# EAGLE design breakout (EAGLE 6.6.0)
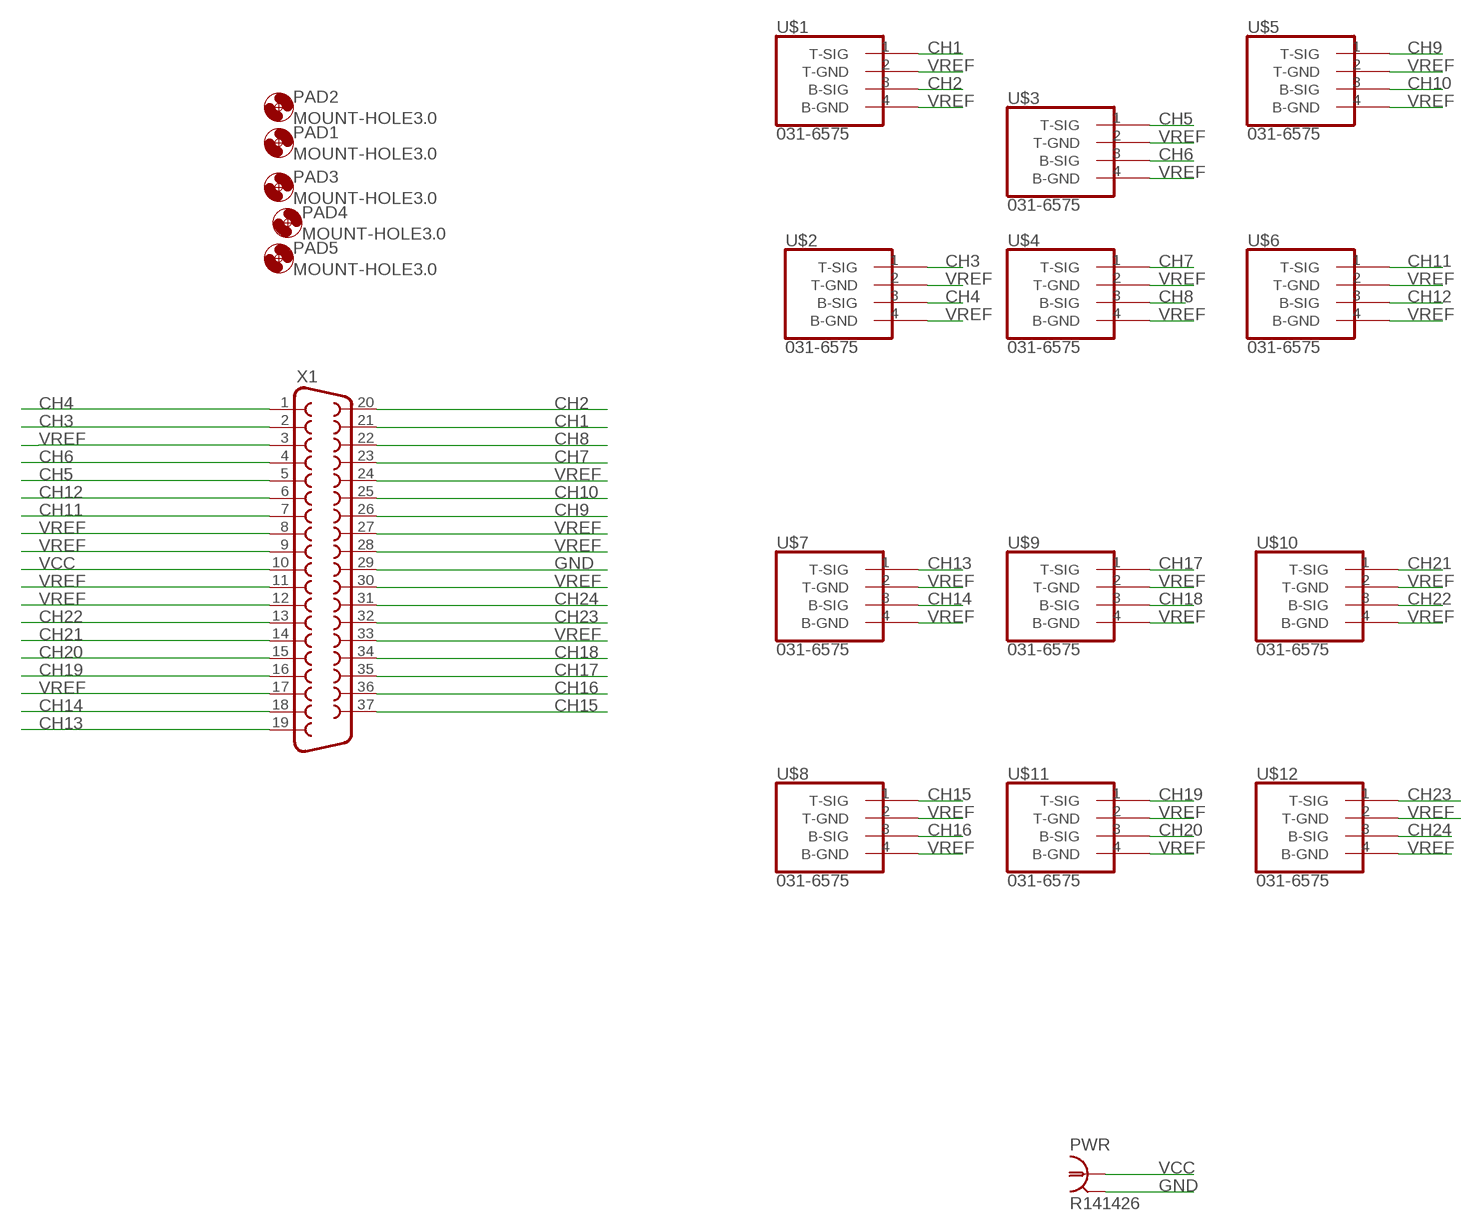
[diagram p0: schematic, sheet 1]

## Parts
PAD1  MOUNT-HOLE3.0  [3,0]
PAD2  MOUNT-HOLE3.0  [3,0]
PAD3  MOUNT-HOLE3.0  [3,0]
PAD4  MOUNT-HOLE3.0  [3,0]
PAD5  MOUNT-HOLE3.0  [3,0]
PWR  R141426  [R141426]
U$1  031-6575  [031-6575]
U$2  031-6575  [031-6575]
U$3  031-6575  [031-6575]
U$4  031-6575  [031-6575]
U$5  031-6575  [031-6575]
U$6  031-6575  [031-6575]
U$7  031-6575  [031-6575]
U$8  031-6575  [031-6575]
U$9  031-6575  [031-6575]
U$10  031-6575  [031-6575]
U$11  031-6575  [031-6575]
U$12  031-6575  [031-6575]
X1  F37HP  [F37HP]

## Nets
CH1: U$1.1(T-SIG) X1.21
CH2: U$1.3(B-SIG) X1.20
CH3: U$2.1(T-SIG) X1.2
CH4: U$2.3(B-SIG) X1.1
CH5: U$3.1(T-SIG) X1.5
CH6: U$3.3(B-SIG) X1.4
CH7: U$4.1(T-SIG) X1.23
CH8: U$4.3(B-SIG) X1.22
CH9: U$5.1(T-SIG) X1.26
CH10: U$5.3(B-SIG) X1.25
CH11: U$6.1(T-SIG) X1.7
CH12: U$6.3(B-SIG) X1.6
CH13: U$7.1(T-SIG) X1.19
CH14: U$7.3(B-SIG) X1.18
CH15: U$8.1(T-SIG) X1.37
CH16: U$8.3(B-SIG) X1.36
CH17: U$9.1(T-SIG) X1.35
CH18: U$9.3(B-SIG) X1.34
CH19: U$11.1(T-SIG) X1.16
CH20: U$11.3(B-SIG) X1.15
CH21: U$10.1(T-SIG) X1.14
CH22: U$10.3(B-SIG) X1.13
CH23: U$12.1(T-SIG) X1.32
CH24: U$12.3(B-SIG) X1.31
GND: PWR.2 PWR.3 PWR.4 PWR.5 X1.29
VCC: PWR.1 X1.10
VREF: U$1.2(T-GND) U$1.4(B-GND) U$2.2(T-GND) U$2.4(B-GND) U$3.2(T-GND) U$3.4(B-GND) U$4.2(T-GND) U$4.4(B-GND) U$5.2(T-GND) U$5.4(B-GND) U$6.2(T-GND) U$6.4(B-GND) U$7.2(T-GND) U$7.4(B-GND) U$8.2(T-GND) U$8.4(B-GND) U$9.2(T-GND) U$9.4(B-GND) U$10.2(T-GND) U$10.4(B-GND) U$11.2(T-GND) U$11.4(B-GND) U$12.2(T-GND) U$12.4(B-GND) X1.3 X1.8 X1.9 X1.11 X1.12 X1.17 X1.24 X1.27 X1.28 X1.30 X1.33

## Library data of the parts
PAD1-PAD5 = holes:MOUNT-HOLE: MOUNTING HOLE with drill center marker
PWR = con-coax:R141426: BNC COAX CONNECTOR Radiall 50/75 Ohm Spoerle; MF: FARNELL; MPN: R141426161; OC_FARNELL: 4195115; OC_NEWARK: 14J7919
U$1-U$12 = 031-6575:031-6575: Dual Row BNC Socket Description: BNC Connector Jack, Female Sockets - Dual 50 Ohm Panel Mount, Bulkhead; Through Hole, Right Angle Solder Manufacturer: Amphenol-RF Division Digi-Key Part Number: ARF2111-ND Manufacturer Part Number: 031-6575
X1 = con-subd:F37: SUB-D; OC_FARNELL: unknown; OC_NEWARK: unknown

## Board
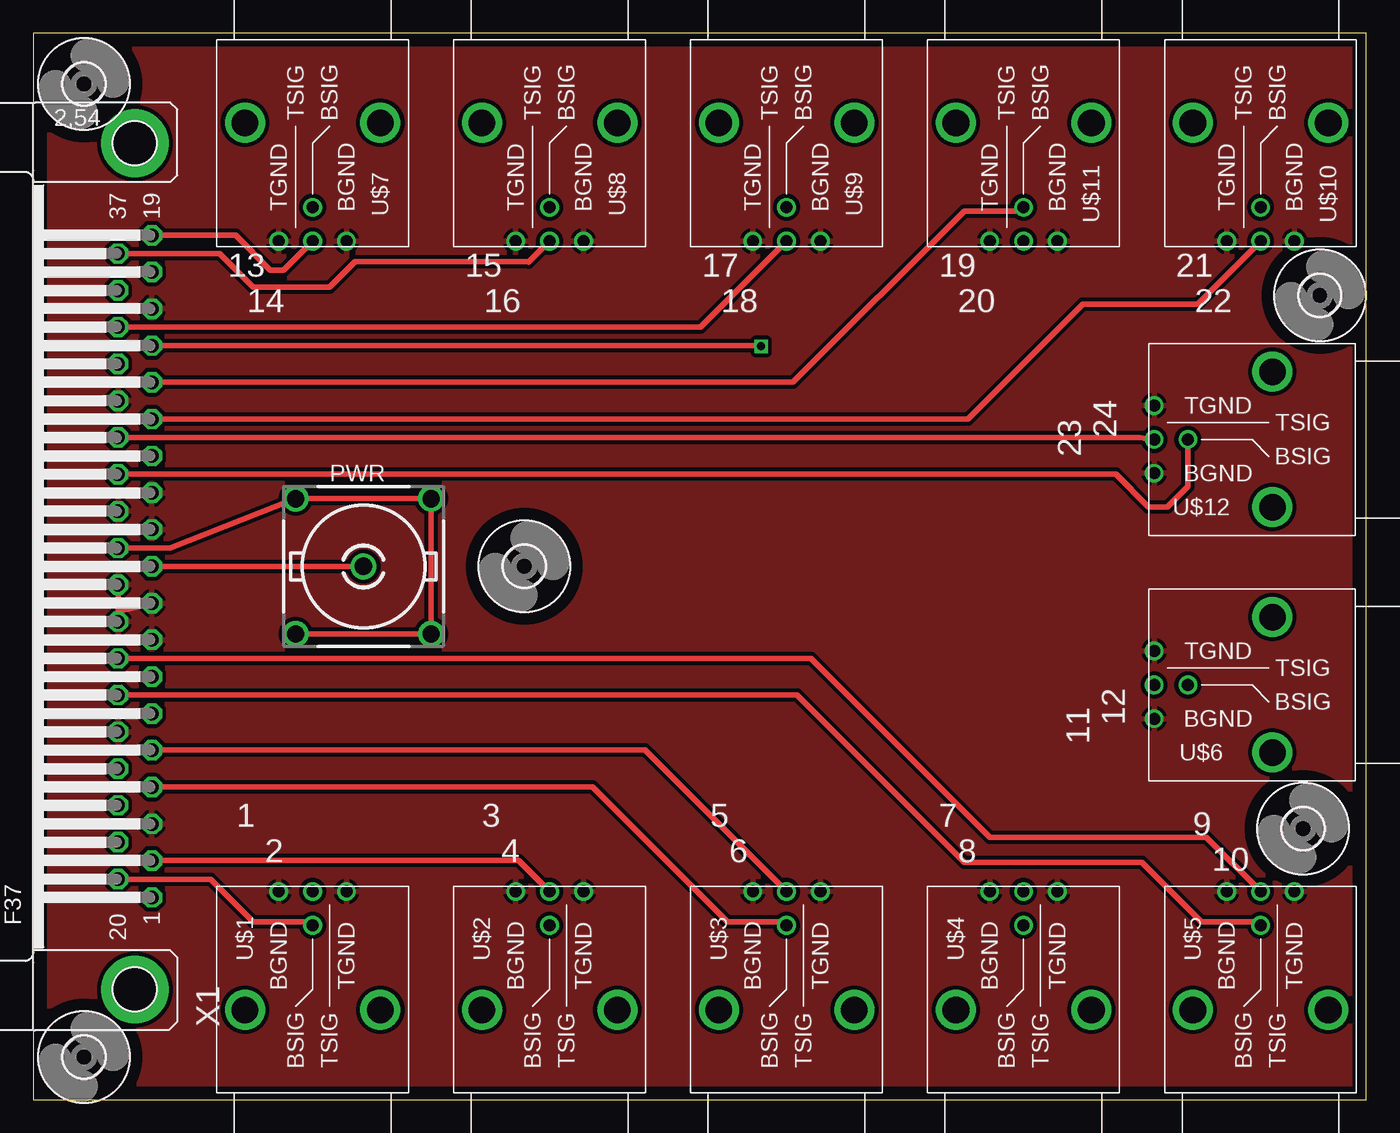
[diagram p1: board, top side]
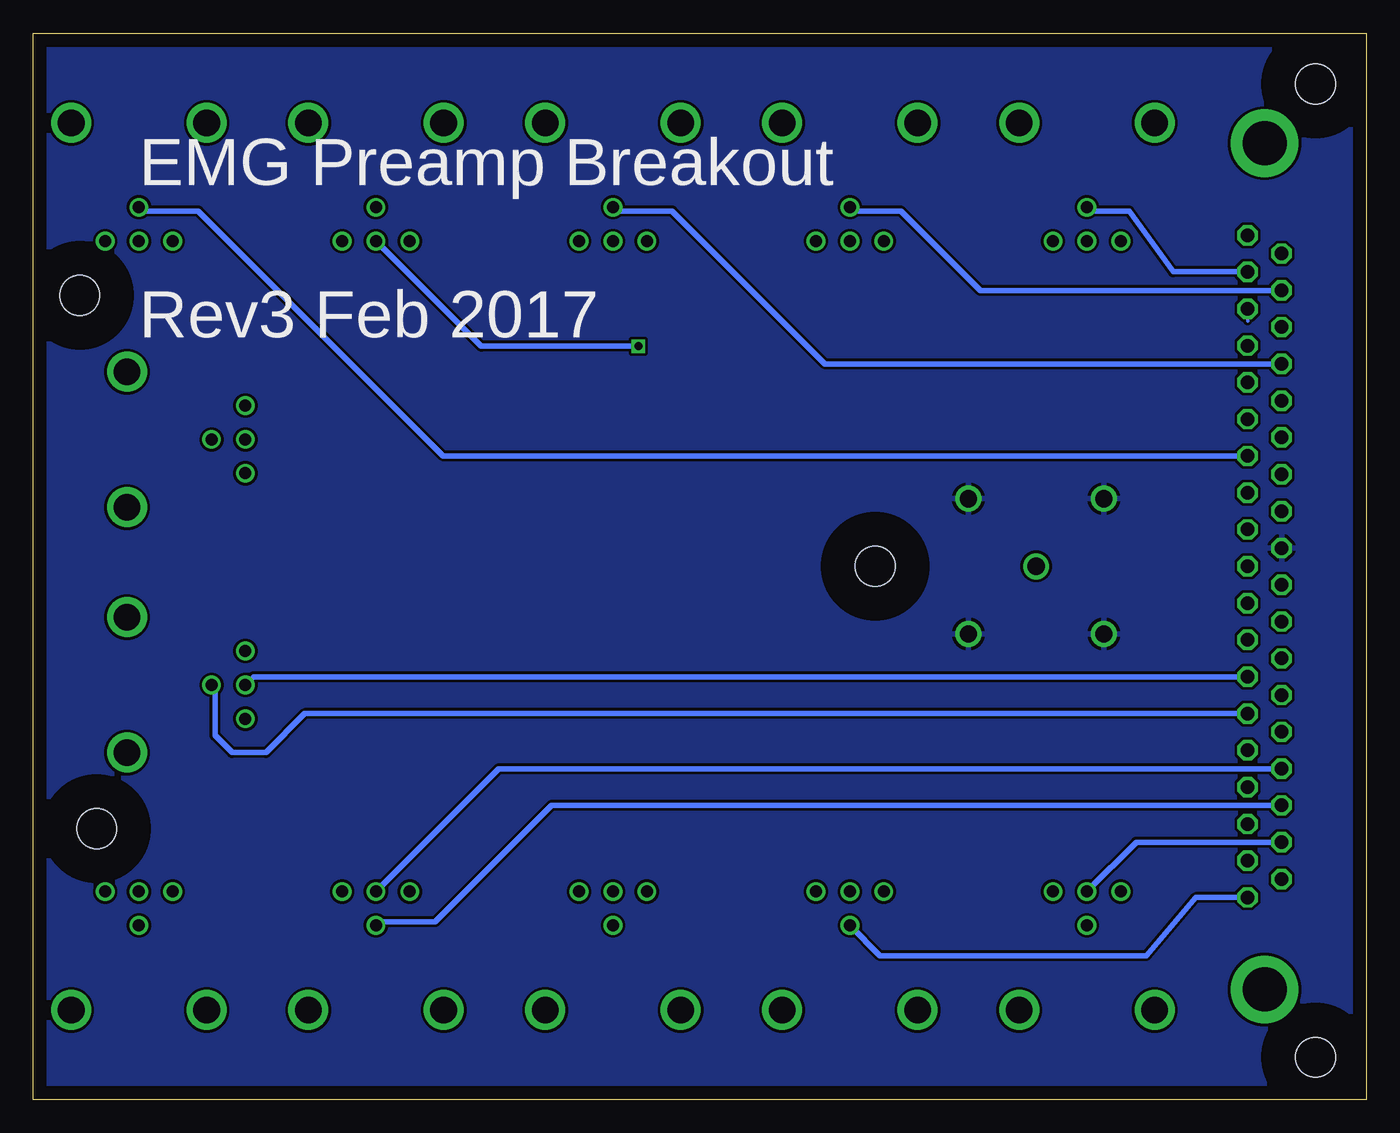
[diagram p2: board, bottom side, seen from below]

Size 100 x 80 mm. Coordinates in mm from the lower left corner, seen from the top.
Outline: 0,0 100,0 100,80 0,80 0,0
Copper layers (1*16): Top 0.035mm / dielectric 1.5mm / Bottom 0.035mm
Design rules "default *": minimum track width 10mil, minimum drill 10mil, track to track 8mil, track to pad 8mil, pad to pad 8mil, via to via 8mil, smd to smd 8mil, copper to edge 40mil, drill to drill 8mil, minimum pad ring 10mil, minimum via ring 8mil, stop-mask expansion 4mil, vias tented up to drill 0mil, thermal gap 10mil

### Footprints (pad centres in the part's own frame; a part is rotated, then mirrored left to right if it is on the bottom)
3,0 = hole 3: 0,0
R141426 = drill 1.295: 1 0,0; 2 5.08,5.08; 3 -5.08,5.08; 4 -5.08,-5.08; 5 5.08,-5.08
031-6575 = drill 0.9: 1 7.35,0; 2 7.35,-2.54; 3 4.81,0; 4 7.35,2.54 | drill 2: P$6 -1.53,5.08; P$7 -1.53,-5.08
F37HP = drill 1.016 octagon: 1 -24.841,-1.27; 2 -22.073,-1.27; 3 -19.329,-1.27; 4 -16.561,-1.27; 5 -13.792,-1.27; 6 -11.049,-1.27; 7 -8.28,-1.27; 8 -5.512,-1.27; 9 -2.769,-1.27; 10 0,-1.27; 11 2.769,-1.27; 12 5.512,-1.27; 13 8.28,-1.27; 14 11.049,-1.27; 15 13.818,-1.27; 16 16.561,-1.27; 17 19.329,-1.27; 18 22.098,-1.27; 19 24.841,-1.27; 20 -23.47,1.27; 21 -20.701,1.27; 22 -17.932,1.27; 23 -15.189,1.27; 24 -12.421,1.27; 25 -9.652,1.27; 26 -6.909,1.27; 27 -4.14,1.27; 28 -1.372,1.27; 29 1.372,1.27; 30 4.14,1.27; 31 6.909,1.27; 32 9.677,1.27; 33 12.421,1.27; 34 15.189,1.27; 35 17.958,1.27; 36 20.701,1.27; 37 23.47,1.27 | drill 3.302 pad 5.08: G1 -31.75,0; G2 31.75,0

### Placement (x,y rotation side)
PAD1  3.81,3.17 0 top
PAD2  3.81,76.2 0 top
PAD3  95.25,20.32 0 top
PAD4  96.52,60.33 0 top
PAD5  36.83,40.01 0 top
PWR  24.77,40.01 0 top
U$1  20.95,8.26 90 top
U$2  38.73,8.26 90 top
U$3  56.52,8.26 90 top
U$4  74.3,8.26 90 top
U$5  92.08,8.26 90 top
U$6  91.44,31.11 180 top
U$7  20.95,71.75 270 top
U$8  38.73,71.75 270 top
U$9  56.52,71.75 270 top
U$10  92.08,71.75 270 top
U$11  74.3,71.75 270 top
U$12  91.44,49.53 180 top
X1  7.62,40.01 90 top

### Tracks (layer width: path | path; a pad name or v marks a point on that pad's centre or on a via)
CH1
  Bottom 0.406: X1.21 17.26,19.3 U$1.1
CH2
  Top 0.406: X1.20 13.31,16.54 16.51,13.34 20.68,13.34 U$1.3
CH3
  Top 0.406: X1.2 36.41,17.93 U$2.1
CH4
  Bottom 0.406: X1.1 12.78,15.16 16.51,10.79 36.47,10.79 U$2.3
CH5
  Top 0.406: X1.5 45.91,26.21 U$3.1
CH6
  Top 0.406: X1.4 41.96,23.44 52.07,13.34 56.24,13.34 U$3.3
CH7
  Bottom 0.406: X1.23 65.08,24.82 U$4.1
CH8
  Bottom 0.406: X1.22 61.11,22.07 69.85,13.34 74.03,13.34 U$4.3
CH9
  Top 0.406: X1.26 58.34,33.1 71.75,19.68 88,19.68 U$5.1
CH10
  Top 0.406: X1.25 57.28,30.35 69.85,17.78 83.19,17.78 87.63,13.34 91.81,13.34 U$5.3
CH11
  Bottom 0.406: X1.7 83.48,31.73 U$6.1
CH12
  Bottom 0.406: X1.6 79.63,28.96 82.55,26.04 85.09,26.04 86.36,27.3 86.36,30.84 U$6.3
CH13
  Top 0.406: X1.19 15.16,64.85 17.78,62.23 18.78,62.23 U$7.1
CH14
  Bottom 0.406: X1.18 14.48,62.1 17.78,66.67 20.68,66.67 U$7.3
CH15
  Top 0.406: 37.17,62.84 37.2,62.87 | 37.2,62.87 U$8.1 | X1.37 13.99,63.48 16.51,60.96 22.23,60.96 24.13,62.87 37.2,62.87
CH16
  Bottom 0.406: X1.36 28.96,60.71 34.92,66.67 38.47,66.67 U$8.3
CH17
  Top 0.406: U$9.1 50.07,57.96 X1.35
CH18
  Bottom 0.406: X1.34 40.59,55.19 52.07,66.67 56.24,66.67 U$9.3
CH19  (via drill 0.6)
  Top 0.406: X1.16 54.56,56.57 v54.61,56.52
  Bottom 0.406: v54.61,56.52 66.41,56.52 U$11.1
CH20
  Top 0.406: X1.15 57,53.82 69.85,66.67 74.03,66.67 U$11.3
CH21
  Top 0.406: X1.14 70.1,51.05 78.74,59.69 87.36,59.69 U$10.1
CH22
  Bottom 0.406: X1.13 69.24,48.28 87.63,66.67 91.81,66.67 U$10.3
CH23
  Top 0.406: X1.32 82.97,49.68 U$12.1
CH24
  Top 0.406: X1.31 81.2,46.91 83.67,44.45 85.09,44.45 86.63,45.99 U$12.3
GND
  Top 0.406: PWR.4 PWR.5 PWR.2 PWR.3 10.26,41.38 X1.29
  pour Bottom: 0,80.01 0,0 99.69,0 99.69,80.01
VCC
  Top 0.406: X1.10 PWR.1
VREF
  Top 0.254: 6.35,38.1 X1.28
  Top 0.406: X1.9 6.35,36.6 | 6.35,36.6 X1.27 | X1.28 6.35,36.6
  Bottom 0.254: 8.89,58.42 X1.17
  pour Top (isolate 0.305): 0,0 99.69,0 99.69,80.01 0,80.01

### Text on the board
tNames: 13 / 14 | 15 / 16 | 17 / 18 | 19 / 20 | 21 / 22 | 23 / 24 | 11 / 12 | 1 / 2 | 3 / 4 | 5 / 6 | 7 / 8 | 9 / 10
bNames: EMG Preamp Breakout | Rev3 Feb 2017